# EAGLE board Decoder4to16 (EAGLE 7.3.0), part 1 of 2
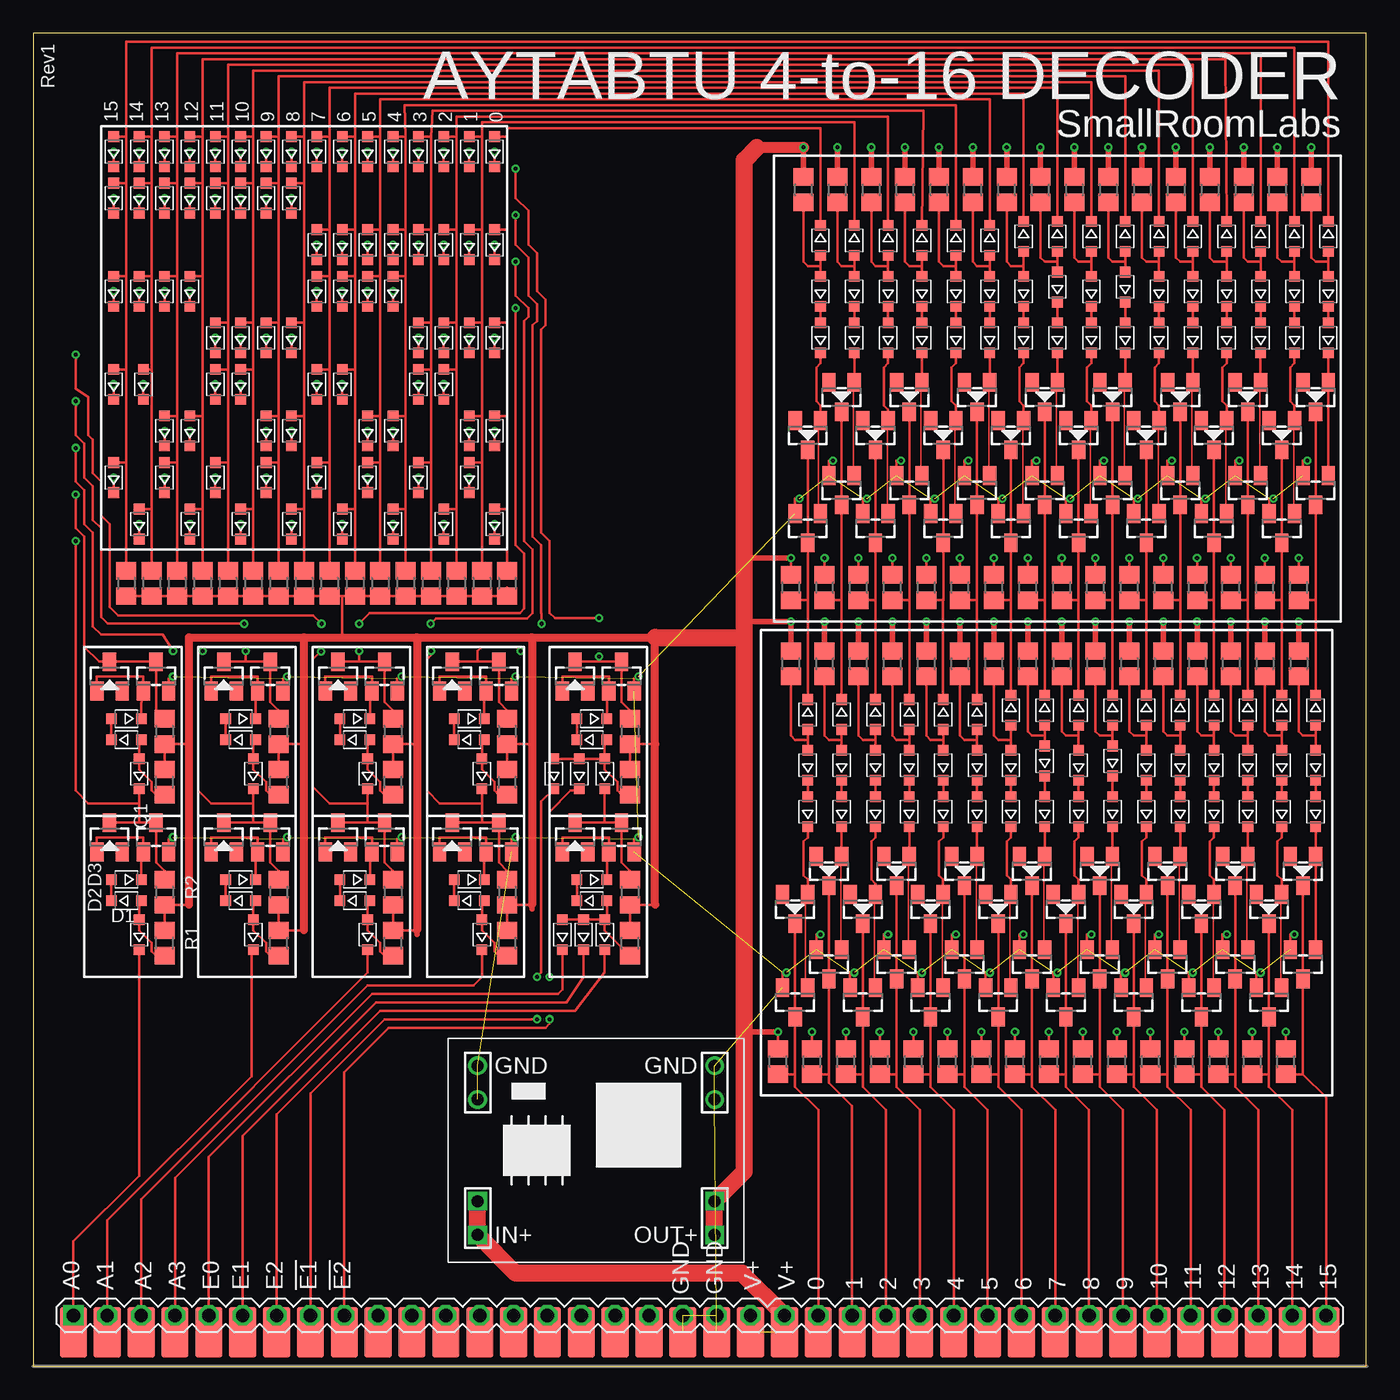
[diagram p2: board, top side]
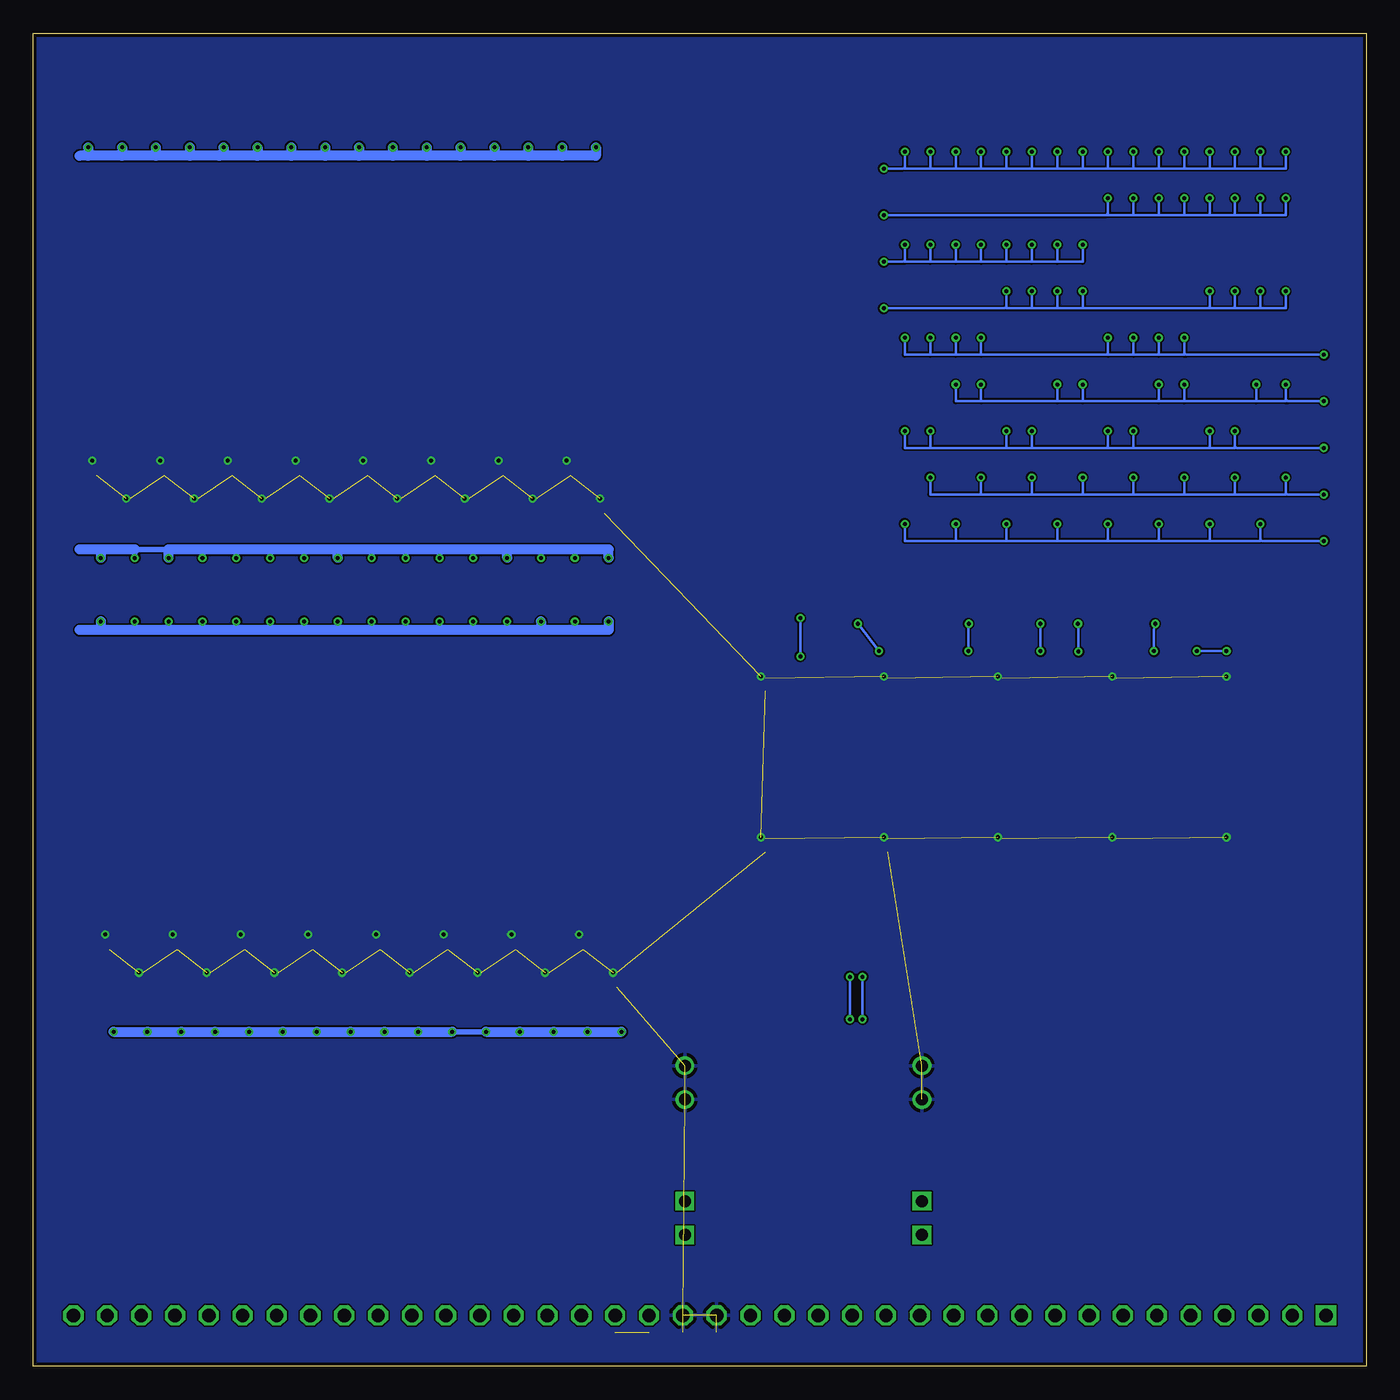
[diagram p3: board, bottom side, seen from below]

Size 100 x 100 mm. Coordinates in mm from the lower left corner, seen from the top.
Outline: 0,0 100,0 100,100 0,100 0,0
Copper layers (1*16): Top 0.035mm / dielectric 1.5mm / Bottom 0.035mm
Design rules "dirt_cheap_dirty_boards.v1": minimum track width 5mil, minimum drill 12mil, track to track 5mil, track to pad 5mil, pad to pad 5mil, via to via 5mil, smd to smd 0mil, copper to edge 10mil, drill to drill 10mil, minimum pad ring 10mil, minimum via ring 6mil, stop-mask expansion 2mil, vias tented up to drill 25mil, thermal gap 10mil

## Footprints (pad centres in the part's own frame; a part is rotated, then mirrored left to right if it is on the bottom)
HD38-HOLEPAD = drill 1 square: P1@1 -46.99,0 | smd 2.032 x 3.81: P1@2 -46.99,-1.27; P2@2 -44.45,-1.27; P3@2 -41.91,-1.27; P4@2 -39.37,-1.27; P5@2 -36.83,-1.27; P6@2 -34.29,-1.27; P7@2 -31.75,-1.27; P8@2 -29.21,-1.27; P9@2 -26.67,-1.27; P10@2 -24.13,-1.27; P11@2 -21.59,-1.27; P12@2 -19.05,-1.27; P13@2 -16.51,-1.27; P14@2 -13.97,-1.27; P15@2 -11.43,-1.27; P16@2 -8.89,-1.27; P17@2 -6.35,-1.27; P18@2 -3.81,-1.27; P19@2 -1.27,-1.27; P20@2 1.27,-1.27; P21@2 3.81,-1.27; P22@2 6.35,-1.27; P23@2 8.89,-1.27; P24@2 11.43,-1.27; P25@2 13.97,-1.27; P26@2 16.51,-1.27; P27@2 19.05,-1.27; P28@2 21.59,-1.27; P29@2 24.13,-1.27; P30@2 26.67,-1.27; P31@2 29.21,-1.27; P32@2 31.75,-1.27; P33@2 34.29,-1.27; P34@2 36.83,-1.27; P35@2 39.37,-1.27; P36@2 41.91,-1.27; P37@2 44.45,-1.27; P38@2 46.99,-1.27 | drill 1 octagon: P2@1 -44.45,0; P3@1 -41.91,0; P4@1 -39.37,0; P5@1 -36.83,0; P6@1 -34.29,0; P7@1 -31.75,0; P8@1 -29.21,0; P9@1 -26.67,0; P10@1 -24.13,0; P11@1 -21.59,0; P12@1 -19.05,0; P13@1 -16.51,0; P14@1 -13.97,0; P15@1 -11.43,0; P16@1 -8.89,0; P17@1 -6.35,0; P18@1 -3.81,0; P19@1 -1.27,0; P20@1 1.27,0; P21@1 3.81,0; P22@1 6.35,0; P23@1 8.89,0; P24@1 11.43,0; P25@1 13.97,0; P26@1 16.51,0; P27@1 19.05,0; P28@1 21.59,0; P29@1 24.13,0; P30@1 26.67,0; P31@1 29.21,0; P32@1 31.75,0; P33@1 34.29,0; P34@1 36.83,0; P35@1 39.37,0; P36@1 41.91,0; P37@1 44.45,0; P38@1 46.99,0
SOD323F = smd 0.8 x 0.8: A 1.125,0; C -1.125,0
SOT23 = smd 1 x 1.4: 1 -0.95,-1.1; 2 0.95,-1.1; 3 0,1.1
R0805 = smd 1.3 x 1.5: 1 -0.95,0; 2 0.95,0
BUCK1722 = drill 0.9: GND@1 -8.89,6.35; GND@2 -8.89,3.81; GND@3 8.89,6.35; GND@4 8.89,3.81 | drill 0.9 square: IN@1 -8.89,-3.81; IN@2 -8.89,-6.35; OUT@1 8.89,-3.81; OUT@2 8.89,-6.35

## Placement (x,y rotation side)
CN1  HD38-HP  [HD38-HOLEPAD]  50,3.81 0 top
D1  DIODE-SOD323  [SOD323F]  7.94,32.38 90 top
D2  DIODE-SOD323  [SOD323F]  6.99,34.92 0 top
D3  DIODE-SOD323  [SOD323F]  6.99,36.51 180 top
D4  SCHOTTKYSOT323  [SOT23]  5.71,39.69 0 top
D5  DIODE-SOD323  [SOD323F]  6.99,48.58 180 top
D6  DIODE-SOD323  [SOD323F]  6.99,46.99 0 top
D7  DIODE-SOD323  [SOD323F]  7.94,44.45 90 top
D8  SCHOTTKYSOT323  [SOT23]  5.71,51.75 0 top
D9  DIODE-SOD323  [SOD323F]  15.56,36.51 180 top
D10  DIODE-SOD323  [SOD323F]  15.56,34.92 0 top
D11  DIODE-SOD323  [SOD323F]  16.51,32.38 90 top
D12  SCHOTTKYSOT323  [SOT23]  14.29,39.69 0 top
D13  DIODE-SOD323  [SOD323F]  15.56,48.58 180 top
D14  DIODE-SOD323  [SOD323F]  15.56,46.99 0 top
D15  DIODE-SOD323  [SOD323F]  16.51,44.45 90 top
D16  SCHOTTKYSOT323  [SOT23]  14.29,51.75 0 top
D17  DIODE-SOD323  [SOD323F]  24.13,36.51 180 top
D18  DIODE-SOD323  [SOD323F]  24.13,34.92 0 top
D19  DIODE-SOD323  [SOD323F]  25.08,32.38 90 top
D20  SCHOTTKYSOT323  [SOT23]  22.86,39.69 0 top
D21  DIODE-SOD323  [SOD323F]  24.13,48.58 180 top
D22  DIODE-SOD323  [SOD323F]  24.13,46.99 0 top
D23  DIODE-SOD323  [SOD323F]  25.08,44.45 90 top
D24  SCHOTTKYSOT323  [SOT23]  22.86,51.75 0 top
D25  DIODE-SOD323  [SOD323F]  32.7,36.51 180 top
D26  DIODE-SOD323  [SOD323F]  32.7,34.92 0 top
D27  DIODE-SOD323  [SOD323F]  33.66,32.38 90 top
D28  SCHOTTKYSOT323  [SOT23]  31.43,39.69 0 top
D29  DIODE-SOD323  [SOD323F]  34.61,91.12 90 top
D30  DIODE-SOD323  [SOD323F]  34.61,63.18 90 top
D31  DIODE-SOD323  [SOD323F]  34.61,70.17 90 top
D32  DIODE-SOD323  [SOD323F]  34.61,77.15 90 top
D33  DIODE-SOD323  [SOD323F]  34.61,84.14 90 top
D34  DIODE-SOD323  [SOD323F]  32.7,91.12 90 top
D35  DIODE-SOD323  [SOD323F]  32.7,66.67 90 top
D36  DIODE-SOD323  [SOD323F]  32.7,70.17 90 top
D37  DIODE-SOD323  [SOD323F]  32.7,77.15 90 top
D38  DIODE-SOD323  [SOD323F]  32.7,84.14 90 top
D39  DIODE-SOD323  [SOD323F]  30.8,91.12 90 top
D40  DIODE-SOD323  [SOD323F]  30.8,63.18 90 top
D41  DIODE-SOD323  [SOD323F]  30.8,73.66 90 top
D42  DIODE-SOD323  [SOD323F]  30.8,77.15 90 top
D43  DIODE-SOD323  [SOD323F]  30.8,84.14 90 top
D44  DIODE-SOD323  [SOD323F]  28.89,91.12 90 top
D45  DIODE-SOD323  [SOD323F]  28.89,66.67 90 top
D46  DIODE-SOD323  [SOD323F]  28.89,73.66 90 top
D47  DIODE-SOD323  [SOD323F]  28.89,77.15 90 top
D48  DIODE-SOD323  [SOD323F]  28.89,84.14 90 top
D49  DIODE-SOD323  [SOD323F]  26.99,91.12 90 top
D50  DIODE-SOD323  [SOD323F]  26.99,63.18 90 top
D51  DIODE-SOD323  [SOD323F]  26.99,70.17 90 top
D52  DIODE-SOD323  [SOD323F]  26.99,80.64 90 top
D53  DIODE-SOD323  [SOD323F]  26.99,84.14 90 top
D54  DIODE-SOD323  [SOD323F]  25.08,91.12 90 top
D55  DIODE-SOD323  [SOD323F]  25.08,66.67 90 top
D56  DIODE-SOD323  [SOD323F]  25.08,70.17 90 top
D57  DIODE-SOD323  [SOD323F]  25.08,80.64 90 top
D58  DIODE-SOD323  [SOD323F]  25.08,84.14 90 top
D59  DIODE-SOD323  [SOD323F]  23.18,91.12 90 top
D60  DIODE-SOD323  [SOD323F]  23.18,63.18 90 top
D61  DIODE-SOD323  [SOD323F]  23.18,73.66 90 top
D62  DIODE-SOD323  [SOD323F]  23.18,80.64 90 top
D63  DIODE-SOD323  [SOD323F]  23.18,84.14 90 top
D64  DIODE-SOD323  [SOD323F]  21.27,91.12 90 top
D65  DIODE-SOD323  [SOD323F]  21.27,66.67 90 top
D66  DIODE-SOD323  [SOD323F]  21.27,73.66 90 top
D67  DIODE-SOD323  [SOD323F]  21.27,80.64 90 top
D68  DIODE-SOD323  [SOD323F]  21.27,84.14 90 top
D69  DIODE-SOD323  [SOD323F]  19.37,91.12 90 top
D70  DIODE-SOD323  [SOD323F]  19.37,63.18 90 top
D71  DIODE-SOD323  [SOD323F]  19.37,70.17 90 top
D72  DIODE-SOD323  [SOD323F]  19.37,77.15 90 top
D73  DIODE-SOD323  [SOD323F]  19.37,87.63 90 top
D74  DIODE-SOD323  [SOD323F]  17.46,91.12 90 top
D75  DIODE-SOD323  [SOD323F]  17.46,66.67 90 top
D76  DIODE-SOD323  [SOD323F]  17.46,70.17 90 top
D77  DIODE-SOD323  [SOD323F]  17.46,77.15 90 top
D78  DIODE-SOD323  [SOD323F]  17.46,87.63 90 top
D79  DIODE-SOD323  [SOD323F]  15.56,91.12 90 top
D80  DIODE-SOD323  [SOD323F]  15.56,63.18 90 top
D81  DIODE-SOD323  [SOD323F]  15.56,73.66 90 top
D82  DIODE-SOD323  [SOD323F]  15.56,77.15 90 top
D83  DIODE-SOD323  [SOD323F]  15.56,87.63 90 top
D84  DIODE-SOD323  [SOD323F]  13.65,91.12 90 top
D85  DIODE-SOD323  [SOD323F]  13.65,66.67 90 top
D86  DIODE-SOD323  [SOD323F]  13.65,73.66 90 top
D87  DIODE-SOD323  [SOD323F]  13.65,77.15 90 top
D88  DIODE-SOD323  [SOD323F]  13.65,87.63 90 top
D89  DIODE-SOD323  [SOD323F]  11.75,91.12 90 top
D90  DIODE-SOD323  [SOD323F]  11.75,63.18 90 top
D91  DIODE-SOD323  [SOD323F]  11.75,70.17 90 top
D92  DIODE-SOD323  [SOD323F]  11.75,80.64 90 top
D93  DIODE-SOD323  [SOD323F]  11.75,87.63 90 top
D94  DIODE-SOD323  [SOD323F]  9.84,91.12 90 top
D95  DIODE-SOD323  [SOD323F]  9.84,66.67 90 top
D96  DIODE-SOD323  [SOD323F]  9.84,70.17 90 top
D97  DIODE-SOD323  [SOD323F]  9.84,80.64 90 top
D98  DIODE-SOD323  [SOD323F]  9.84,87.63 90 top
D99  DIODE-SOD323  [SOD323F]  7.94,91.12 90 top
D100  DIODE-SOD323  [SOD323F]  7.94,63.18 90 top
D101  DIODE-SOD323  [SOD323F]  8.26,73.66 90 top
D102  DIODE-SOD323  [SOD323F]  7.94,80.64 90 top
D103  DIODE-SOD323  [SOD323F]  7.94,87.63 90 top
D104  DIODE-SOD323  [SOD323F]  6.03,91.12 90 top
D105  DIODE-SOD323  [SOD323F]  6.03,66.67 90 top
D106  DIODE-SOD323  [SOD323F]  6.03,73.66 90 top
D107  DIODE-SOD323  [SOD323F]  6.03,80.64 90 top
D108  DIODE-SOD323  [SOD323F]  6.03,87.63 90 top
D109  DIODE-SOD323  [SOD323F]  32.7,48.58 180 top
D110  DIODE-SOD323  [SOD323F]  32.7,46.99 0 top
D111  DIODE-SOD323  [SOD323F]  33.66,44.45 90 top
D112  SCHOTTKYSOT323  [SOT23]  31.43,51.75 0 top
D113  DIODE-SOD323  [SOD323F]  41.91,36.51 180 top
D114  DIODE-SOD323  [SOD323F]  41.91,34.92 0 top
D115  DIODE-SOD323  [SOD323F]  39.69,32.38 90 top
D116  SCHOTTKYSOT323  [SOT23]  40.64,39.69 0 top
D117  DIODE-SOD323  [SOD323F]  41.27,32.38 90 top
D118  DIODE-SOD323  [SOD323F]  42.86,32.38 90 top
D119  DIODE-SOD323  [SOD323F]  41.91,48.58 180 top
D120  DIODE-SOD323  [SOD323F]  41.91,46.99 0 top
D121  DIODE-SOD323  [SOD323F]  42.86,44.45 90 top
D122  SCHOTTKYSOT323  [SOT23]  40.64,51.75 0 top
D123  DIODE-SOD323  [SOD323F]  39.05,44.45 90 top
D124  DIODE-SOD323  [SOD323F]  40.96,44.45 90 top
D125  SCHOTTKYSOT323  [SOT23]  95.25,37.15 180 top
D126  SCHOTTKYSOT323  [SOT23]  92.71,34.29 180 top
D127  SCHOTTKYSOT323  [SOT23]  90.17,37.15 180 top
D128  SCHOTTKYSOT323  [SOT23]  87.63,34.29 180 top
D129  SCHOTTKYSOT323  [SOT23]  85.09,37.15 180 top
D130  SCHOTTKYSOT323  [SOT23]  82.55,34.29 180 top
D131  SCHOTTKYSOT323  [SOT23]  80.01,37.15 180 top
D132  SCHOTTKYSOT323  [SOT23]  77.47,34.29 180 top
D133  SCHOTTKYSOT323  [SOT23]  74.93,37.15 180 top
D134  SCHOTTKYSOT323  [SOT23]  72.39,34.29 180 top
D135  SCHOTTKYSOT323  [SOT23]  69.85,37.15 180 top
D136  SCHOTTKYSOT323  [SOT23]  67.31,34.29 180 top
D137  SCHOTTKYSOT323  [SOT23]  64.77,37.15 180 top
D138  SCHOTTKYSOT323  [SOT23]  62.23,34.29 180 top
D139  SCHOTTKYSOT323  [SOT23]  59.69,37.15 180 top
D140  SCHOTTKYSOT323  [SOT23]  57.15,34.29 180 top
D141  DIODE-SOD323  [SOD323F]  58.1,41.59 90 top
D142  DIODE-SOD323  [SOD323F]  58.1,45.09 90 top
D143  DIODE-SOD323  [SOD323F]  60.64,41.59 90 top
D144  DIODE-SOD323  [SOD323F]  60.64,45.09 90 top
D145  DIODE-SOD323  [SOD323F]  63.18,41.59 90 top
D146  DIODE-SOD323  [SOD323F]  63.18,45.09 90 top
D147  DIODE-SOD323  [SOD323F]  65.72,41.59 90 top
D148  DIODE-SOD323  [SOD323F]  65.72,45.09 90 top
D149  DIODE-SOD323  [SOD323F]  68.26,41.59 90 top
D150  DIODE-SOD323  [SOD323F]  68.26,45.09 90 top
D151  DIODE-SOD323  [SOD323F]  70.8,41.59 90 top
D152  DIODE-SOD323  [SOD323F]  70.8,45.09 90 top
D153  DIODE-SOD323  [SOD323F]  73.34,41.59 90 top
D154  DIODE-SOD323  [SOD323F]  73.34,45.09 90 top
D155  DIODE-SOD323  [SOD323F]  75.88,41.59 90 top
D156  DIODE-SOD323  [SOD323F]  75.88,45.4 90 top
D157  DIODE-SOD323  [SOD323F]  96.2,41.59 90 top
D158  DIODE-SOD323  [SOD323F]  96.2,45.09 90 top
D159  DIODE-SOD323  [SOD323F]  93.66,41.59 90 top
D160  DIODE-SOD323  [SOD323F]  93.66,45.09 90 top
D161  DIODE-SOD323  [SOD323F]  91.12,41.59 90 top
D162  DIODE-SOD323  [SOD323F]  91.12,45.09 90 top
D163  DIODE-SOD323  [SOD323F]  88.58,41.59 90 top
D164  DIODE-SOD323  [SOD323F]  88.58,45.09 90 top
D165  DIODE-SOD323  [SOD323F]  86.04,41.59 90 top
D166  DIODE-SOD323  [SOD323F]  86.04,45.09 90 top
D167  DIODE-SOD323  [SOD323F]  83.5,41.59 90 top
D168  DIODE-SOD323  [SOD323F]  83.5,45.09 90 top
D169  DIODE-SOD323  [SOD323F]  80.96,41.59 90 top
D170  DIODE-SOD323  [SOD323F]  80.96,45.4 90 top
D171  DIODE-SOD323  [SOD323F]  78.42,41.59 90 top
D172  DIODE-SOD323  [SOD323F]  78.42,45.09 90 top
D173  DIODE-SOD323  [SOD323F]  96.2,49.21 270 top
D174  DIODE-SOD323  [SOD323F]  93.66,49.21 270 top
D175  DIODE-SOD323  [SOD323F]  91.12,49.21 270 top
D176  DIODE-SOD323  [SOD323F]  88.58,49.21 270 top
D177  DIODE-SOD323  [SOD323F]  86.04,49.21 270 top
D178  DIODE-SOD323  [SOD323F]  83.5,49.21 270 top
D179  DIODE-SOD323  [SOD323F]  80.96,49.21 270 top
D180  DIODE-SOD323  [SOD323F]  78.42,49.21 270 top
D181  DIODE-SOD323  [SOD323F]  75.88,49.21 270 top
D182  DIODE-SOD323  [SOD323F]  73.34,49.21 270 top
D183  DIODE-SOD323  [SOD323F]  70.8,48.9 270 top
D184  DIODE-SOD323  [SOD323F]  68.26,48.9 270 top
D185  DIODE-SOD323  [SOD323F]  65.72,48.9 270 top
D186  DIODE-SOD323  [SOD323F]  63.18,48.9 270 top
D187  DIODE-SOD323  [SOD323F]  60.64,48.9 270 top
D188  DIODE-SOD323  [SOD323F]  58.1,48.9 270 top
D189  SCHOTTKYSOT323  [SOT23]  96.2,72.71 180 top
D190  SCHOTTKYSOT323  [SOT23]  93.66,69.85 180 top
D191  SCHOTTKYSOT323  [SOT23]  91.12,72.71 180 top
D192  SCHOTTKYSOT323  [SOT23]  88.58,69.85 180 top
D193  SCHOTTKYSOT323  [SOT23]  86.04,72.71 180 top
D194  SCHOTTKYSOT323  [SOT23]  83.5,69.85 180 top
D195  SCHOTTKYSOT323  [SOT23]  80.96,72.71 180 top
D196  SCHOTTKYSOT323  [SOT23]  78.42,69.85 180 top
D197  SCHOTTKYSOT323  [SOT23]  75.88,72.71 180 top
D198  SCHOTTKYSOT323  [SOT23]  73.34,69.85 180 top
D199  SCHOTTKYSOT323  [SOT23]  70.8,72.71 180 top
D200  SCHOTTKYSOT323  [SOT23]  68.26,69.85 180 top
D201  SCHOTTKYSOT323  [SOT23]  65.72,72.71 180 top
D202  SCHOTTKYSOT323  [SOT23]  63.18,69.85 180 top
D203  SCHOTTKYSOT323  [SOT23]  60.64,72.71 180 top
D204  SCHOTTKYSOT323  [SOT23]  58.1,69.85 180 top
D205  DIODE-SOD323  [SOD323F]  59.05,77.15 90 top
D206  DIODE-SOD323  [SOD323F]  59.05,80.64 90 top
D207  DIODE-SOD323  [SOD323F]  61.59,77.15 90 top
D208  DIODE-SOD323  [SOD323F]  61.59,80.64 90 top
D209  DIODE-SOD323  [SOD323F]  64.14,77.15 90 top
D210  DIODE-SOD323  [SOD323F]  64.14,80.64 90 top
D211  DIODE-SOD323  [SOD323F]  66.67,77.15 90 top
D212  DIODE-SOD323  [SOD323F]  66.67,80.64 90 top
D213  DIODE-SOD323  [SOD323F]  69.22,77.15 90 top
D214  DIODE-SOD323  [SOD323F]  69.22,80.64 90 top
D215  DIODE-SOD323  [SOD323F]  71.75,77.15 90 top
D216  DIODE-SOD323  [SOD323F]  71.75,80.64 90 top
D217  DIODE-SOD323  [SOD323F]  74.3,77.15 90 top
D218  DIODE-SOD323  [SOD323F]  74.3,80.64 90 top
D219  DIODE-SOD323  [SOD323F]  76.83,77.15 90 top
D220  DIODE-SOD323  [SOD323F]  76.83,80.96 90 top
D221  DIODE-SOD323  [SOD323F]  97.16,77.15 90 top
D222  DIODE-SOD323  [SOD323F]  97.16,80.64 90 top
D223  DIODE-SOD323  [SOD323F]  94.61,77.15 90 top
D224  DIODE-SOD323  [SOD323F]  94.61,80.64 90 top
D225  DIODE-SOD323  [SOD323F]  92.08,77.15 90 top
D226  DIODE-SOD323  [SOD323F]  92.08,80.64 90 top
D227  DIODE-SOD323  [SOD323F]  89.53,77.15 90 top
D228  DIODE-SOD323  [SOD323F]  89.53,80.64 90 top
D229  DIODE-SOD323  [SOD323F]  87,77.15 90 top
D230  DIODE-SOD323  [SOD323F]  87,80.64 90 top
D231  DIODE-SOD323  [SOD323F]  84.45,77.15 90 top
D232  DIODE-SOD323  [SOD323F]  84.45,80.64 90 top
D233  DIODE-SOD323  [SOD323F]  81.92,77.15 90 top
D234  DIODE-SOD323  [SOD323F]  81.92,80.96 90 top
D235  DIODE-SOD323  [SOD323F]  79.38,77.15 90 top
D236  DIODE-SOD323  [SOD323F]  79.38,80.64 90 top
D237  DIODE-SOD323  [SOD323F]  97.16,84.77 270 top
D238  DIODE-SOD323  [SOD323F]  94.61,84.77 270 top
D239  DIODE-SOD323  [SOD323F]  92.08,84.77 270 top
D240  DIODE-SOD323  [SOD323F]  89.53,84.77 270 top
D241  DIODE-SOD323  [SOD323F]  87,84.77 270 top
D242  DIODE-SOD323  [SOD323F]  84.45,84.77 270 top
D243  DIODE-SOD323  [SOD323F]  81.92,84.77 270 top
D244  DIODE-SOD323  [SOD323F]  79.38,84.77 270 top
D245  DIODE-SOD323  [SOD323F]  76.83,84.77 270 top
D246  DIODE-SOD323  [SOD323F]  74.3,84.77 270 top
D247  DIODE-SOD323  [SOD323F]  71.75,84.45 270 top
D248  DIODE-SOD323  [SOD323F]  69.22,84.45 270 top
D249  DIODE-SOD323  [SOD323F]  66.67,84.45 270 top
D250  DIODE-SOD323  [SOD323F]  64.14,84.45 270 top
D251  DIODE-SOD323  [SOD323F]  61.59,84.45 270 top
D252  DIODE-SOD323  [SOD323F]  59.05,84.45 270 top
Q1  BC547-SOT23  [SOT23]  9.21,39.69 0 top
Q2  BC547-SOT23  [SOT23]  9.21,51.75 0 top
Q3  BC547-SOT23  [SOT23]  17.78,39.69 0 top
Q4  BC547-SOT23  [SOT23]  17.78,51.75 0 top
Q5  BC547-SOT23  [SOT23]  26.35,39.69 0 top
Q6  BC547-SOT23  [SOT23]  26.35,51.75 0 top
Q7  BC547-SOT23  [SOT23]  34.92,39.69 0 top
Q8  BC547-SOT23  [SOT23]  34.92,51.75 0 top
Q9  BC547-SOT23  [SOT23]  44.13,39.69 0 top
Q10  BC547-SOT23  [SOT23]  44.13,51.75 0 top
Q11  BC547-SOT23  [SOT23]  95.25,30.16 180 top
Q12  BC547-SOT23  [SOT23]  92.71,27.3 180 top
Q13  BC547-SOT23  [SOT23]  90.17,30.16 180 top
Q14  BC547-SOT23  [SOT23]  87.63,27.3 180 top
Q15  BC547-SOT23  [SOT23]  85.09,30.16 180 top
Q16  BC547-SOT23  [SOT23]  82.55,27.3 180 top
Q17  BC547-SOT23  [SOT23]  80.01,30.16 180 top
Q18  BC547-SOT23  [SOT23]  77.47,27.3 180 top
Q19  BC547-SOT23  [SOT23]  57.15,27.3 180 top
Q20  BC547-SOT23  [SOT23]  59.69,30.16 180 top
Q21  BC547-SOT23  [SOT23]  62.23,27.3 180 top
Q22  BC547-SOT23  [SOT23]  64.77,30.16 180 top
Q23  BC547-SOT23  [SOT23]  67.31,27.3 180 top
Q24  BC547-SOT23  [SOT23]  69.85,30.16 180 top
Q25  BC547-SOT23  [SOT23]  72.39,27.3 180 top
Q26  BC547-SOT23  [SOT23]  74.93,30.16 180 top
Q27  BC547-SOT23  [SOT23]  96.2,65.72 180 top
Q28  BC547-SOT23  [SOT23]  93.66,62.87 180 top
Q29  BC547-SOT23  [SOT23]  91.12,65.72 180 top
Q30  BC547-SOT23  [SOT23]  88.58,62.87 180 top
Q31  BC547-SOT23  [SOT23]  86.04,65.72 180 top
Q32  BC547-SOT23  [SOT23]  83.5,62.87 180 top
Q33  BC547-SOT23  [SOT23]  80.96,65.72 180 top
Q34  BC547-SOT23  [SOT23]  78.42,62.87 180 top
Q35  BC547-SOT23  [SOT23]  58.1,62.87 180 top
Q36  BC547-SOT23  [SOT23]  60.64,65.72 180 top
Q37  BC547-SOT23  [SOT23]  63.18,62.87 180 top
Q38  BC547-SOT23  [SOT23]  65.72,65.72 180 top
Q39  BC547-SOT23  [SOT23]  68.26,62.87 180 top
Q40  BC547-SOT23  [SOT23]  70.8,65.72 180 top
Q41  BC547-SOT23  [SOT23]  73.34,62.87 180 top
Q42  BC547-SOT23  [SOT23]  75.88,65.72 180 top
R1  470  [R0805]  9.84,31.75 90 top
R2  150  [R0805]  9.84,35.56 270 top
R3  150  [R0805]  9.84,47.62 270 top
R4  470  [R0805]  9.84,43.81 90 top
R5  150  [R0805]  18.41,35.56 270 top
R6  470  [R0805]  18.41,31.75 90 top
R7  150  [R0805]  18.41,47.62 270 top
R8  470  [R0805]  18.41,43.81 90 top
R9  150  [R0805]  26.99,35.56 270 top
R10  470  [R0805]  26.99,31.75 90 top
R11  150  [R0805]  26.99,47.62 270 top
R12  470  [R0805]  26.99,43.81 90 top
R13  150  [R0805]  35.56,35.56 270 top
R14  470  [R0805]  35.56,31.75 90 top
R15  150  [R0805]  35.56,47.62 270 top
R16  470  [R0805]  35.56,43.81 90 top
R17  150  [R0805]  44.77,35.56 270 top
R18  470  [R0805]  44.77,31.75 90 top
R19  150  [R0805]  44.77,47.62 270 top
R20  470  [R0805]  44.77,43.81 90 top
R21  R-0805  [R0805]  93.98,22.86 90 top
R22  R-0805  [R0805]  35.56,58.74 270 top
R23  R-0805  [R0805]  33.66,58.74 270 top
R24  R-0805  [R0805]  31.75,58.74 270 top
R25  R-0805  [R0805]  29.84,58.74 270 top
R26  R-0805  [R0805]  27.94,58.74 270 top
R27  R-0805  [R0805]  26.04,58.74 270 top
R28  R-0805  [R0805]  24.13,58.74 270 top
R29  R-0805  [R0805]  22.23,58.74 270 top
R30  R-0805  [R0805]  20.32,58.74 270 top
R31  R-0805  [R0805]  18.41,58.74 270 top
R32  R-0805  [R0805]  16.51,58.74 270 top
R33  R-0805  [R0805]  14.61,58.74 270 top
R34  R-0805  [R0805]  12.7,58.74 270 top
R35  R-0805  [R0805]  10.79,58.74 270 top
R36  R-0805  [R0805]  8.89,58.74 270 top
R37  R-0805  [R0805]  6.99,58.74 270 top
R38  R-0805  [R0805]  91.44,22.86 90 top
R39  R-0805  [R0805]  88.9,22.86 90 top
R40  R-0805  [R0805]  86.36,22.86 90 top
R41  R-0805  [R0805]  83.82,22.86 90 top
R42  R-0805  [R0805]  81.28,22.86 90 top
R43  R-0805  [R0805]  78.74,22.86 90 top
R44  R-0805  [R0805]  76.2,22.86 90 top
R45  R-0805  [R0805]  55.88,22.86 90 top
R46  R-0805  [R0805]  58.42,22.86 90 top
R47  R-0805  [R0805]  60.96,22.86 90 top
R48  R-0805  [R0805]  63.5,22.86 90 top
R49  R-0805  [R0805]  66.04,22.86 90 top
R50  R-0805  [R0805]  68.58,22.86 90 top
R51  R-0805  [R0805]  71.12,22.86 90 top
R52  R-0805  [R0805]  73.66,22.86 90 top
R53  R-0805  [R0805]  94.93,52.7 270 top
R54  R-0805  [R0805]  92.39,52.7 270 top
R55  R-0805  [R0805]  89.85,52.7 270 top
R56  R-0805  [R0805]  87.31,52.7 270 top
R57  R-0805  [R0805]  84.77,52.7 270 top
R58  R-0805  [R0805]  82.23,52.7 270 top
R59  R-0805  [R0805]  79.69,52.7 270 top
R60  R-0805  [R0805]  77.15,52.7 270 top
R61  R-0805  [R0805]  59.37,52.7 90 top
R62  R-0805  [R0805]  61.91,52.7 90 top
R63  R-0805  [R0805]  64.45,52.7 90 top
R64  R-0805  [R0805]  66.99,52.7 90 top
R65  R-0805  [R0805]  69.53,52.7 90 top
R66  R-0805  [R0805]  72.07,52.7 90 top
R67  R-0805  [R0805]  74.61,52.7 90 top
R68  R-0805  [R0805]  56.83,52.7 90 top
R69  R-0805  [R0805]  94.93,58.42 90 top
R70  R-0805  [R0805]  92.39,58.42 90 top
R71  R-0805  [R0805]  89.85,58.42 90 top
R72  R-0805  [R0805]  87.31,58.42 90 top
R73  R-0805  [R0805]  84.77,58.42 90 top
R74  R-0805  [R0805]  82.23,58.42 90 top
R75  R-0805  [R0805]  79.69,58.42 90 top
R76  R-0805  [R0805]  77.15,58.42 90 top
R77  R-0805  [R0805]  56.83,58.42 90 top
R78  R-0805  [R0805]  59.37,58.42 90 top
R79  R-0805  [R0805]  61.91,58.42 90 top
R80  R-0805  [R0805]  64.45,58.42 90 top
R81  R-0805  [R0805]  66.99,58.42 90 top
R82  R-0805  [R0805]  69.53,58.42 90 top
R83  R-0805  [R0805]  72.07,58.42 90 top
R84  R-0805  [R0805]  74.61,58.42 90 top
R85  R-0805  [R0805]  95.89,88.27 270 top
R86  R-0805  [R0805]  93.34,88.27 270 top
R87  R-0805  [R0805]  90.81,88.27 270 top
R88  R-0805  [R0805]  88.27,88.27 270 top
R89  R-0805  [R0805]  85.72,88.27 270 top
R90  R-0805  [R0805]  83.19,88.27 270 top
R91  R-0805  [R0805]  80.64,88.27 270 top
R92  R-0805  [R0805]  78.11,88.27 270 top
R93  R-0805  [R0805]  60.33,88.27 90 top
R94  R-0805  [R0805]  62.87,88.27 90 top
R95  R-0805  [R0805]  65.41,88.27 90 top
R96  R-0805  [R0805]  67.94,88.27 90 top
R97  R-0805  [R0805]  70.48,88.27 90 top
R98  R-0805  [R0805]  73.03,88.27 90 top
R99  R-0805  [R0805]  75.56,88.27 90 top
R100  R-0805  [R0805]  57.78,88.27 90 top
VR1  SMPS  [BUCK1722]  42.23,16.19 0 top